# EAGLE schematic bird_beaks (EAGLE 9.6.2)
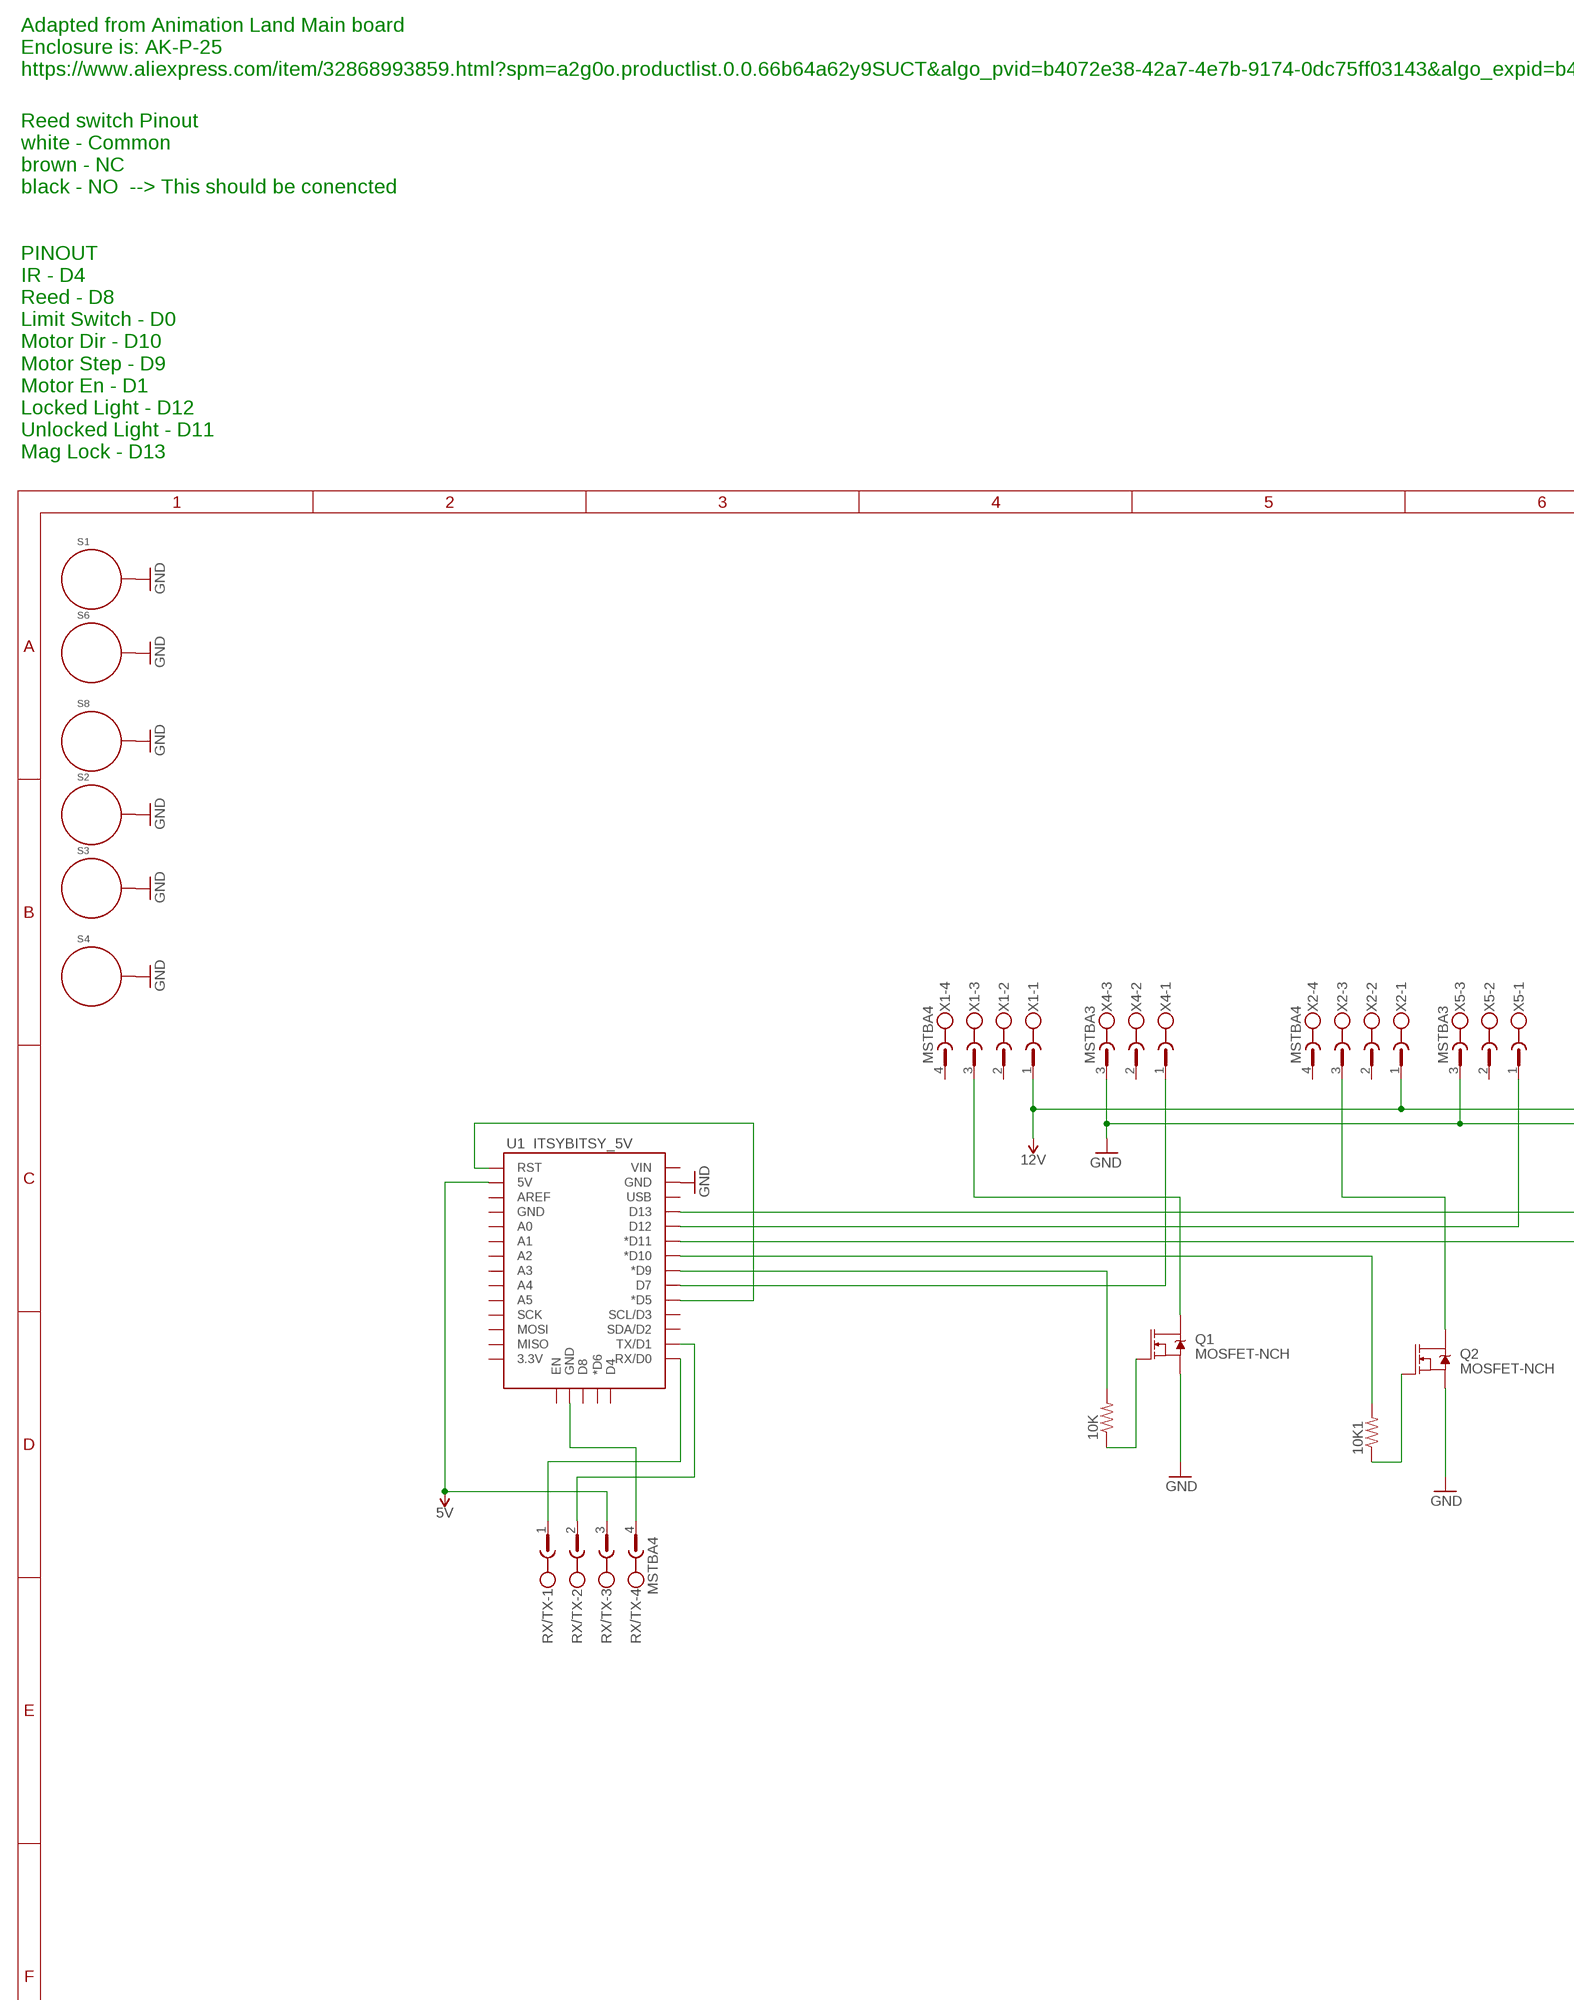
[diagram p0: schematic, sheet 1, part 1 of 2]
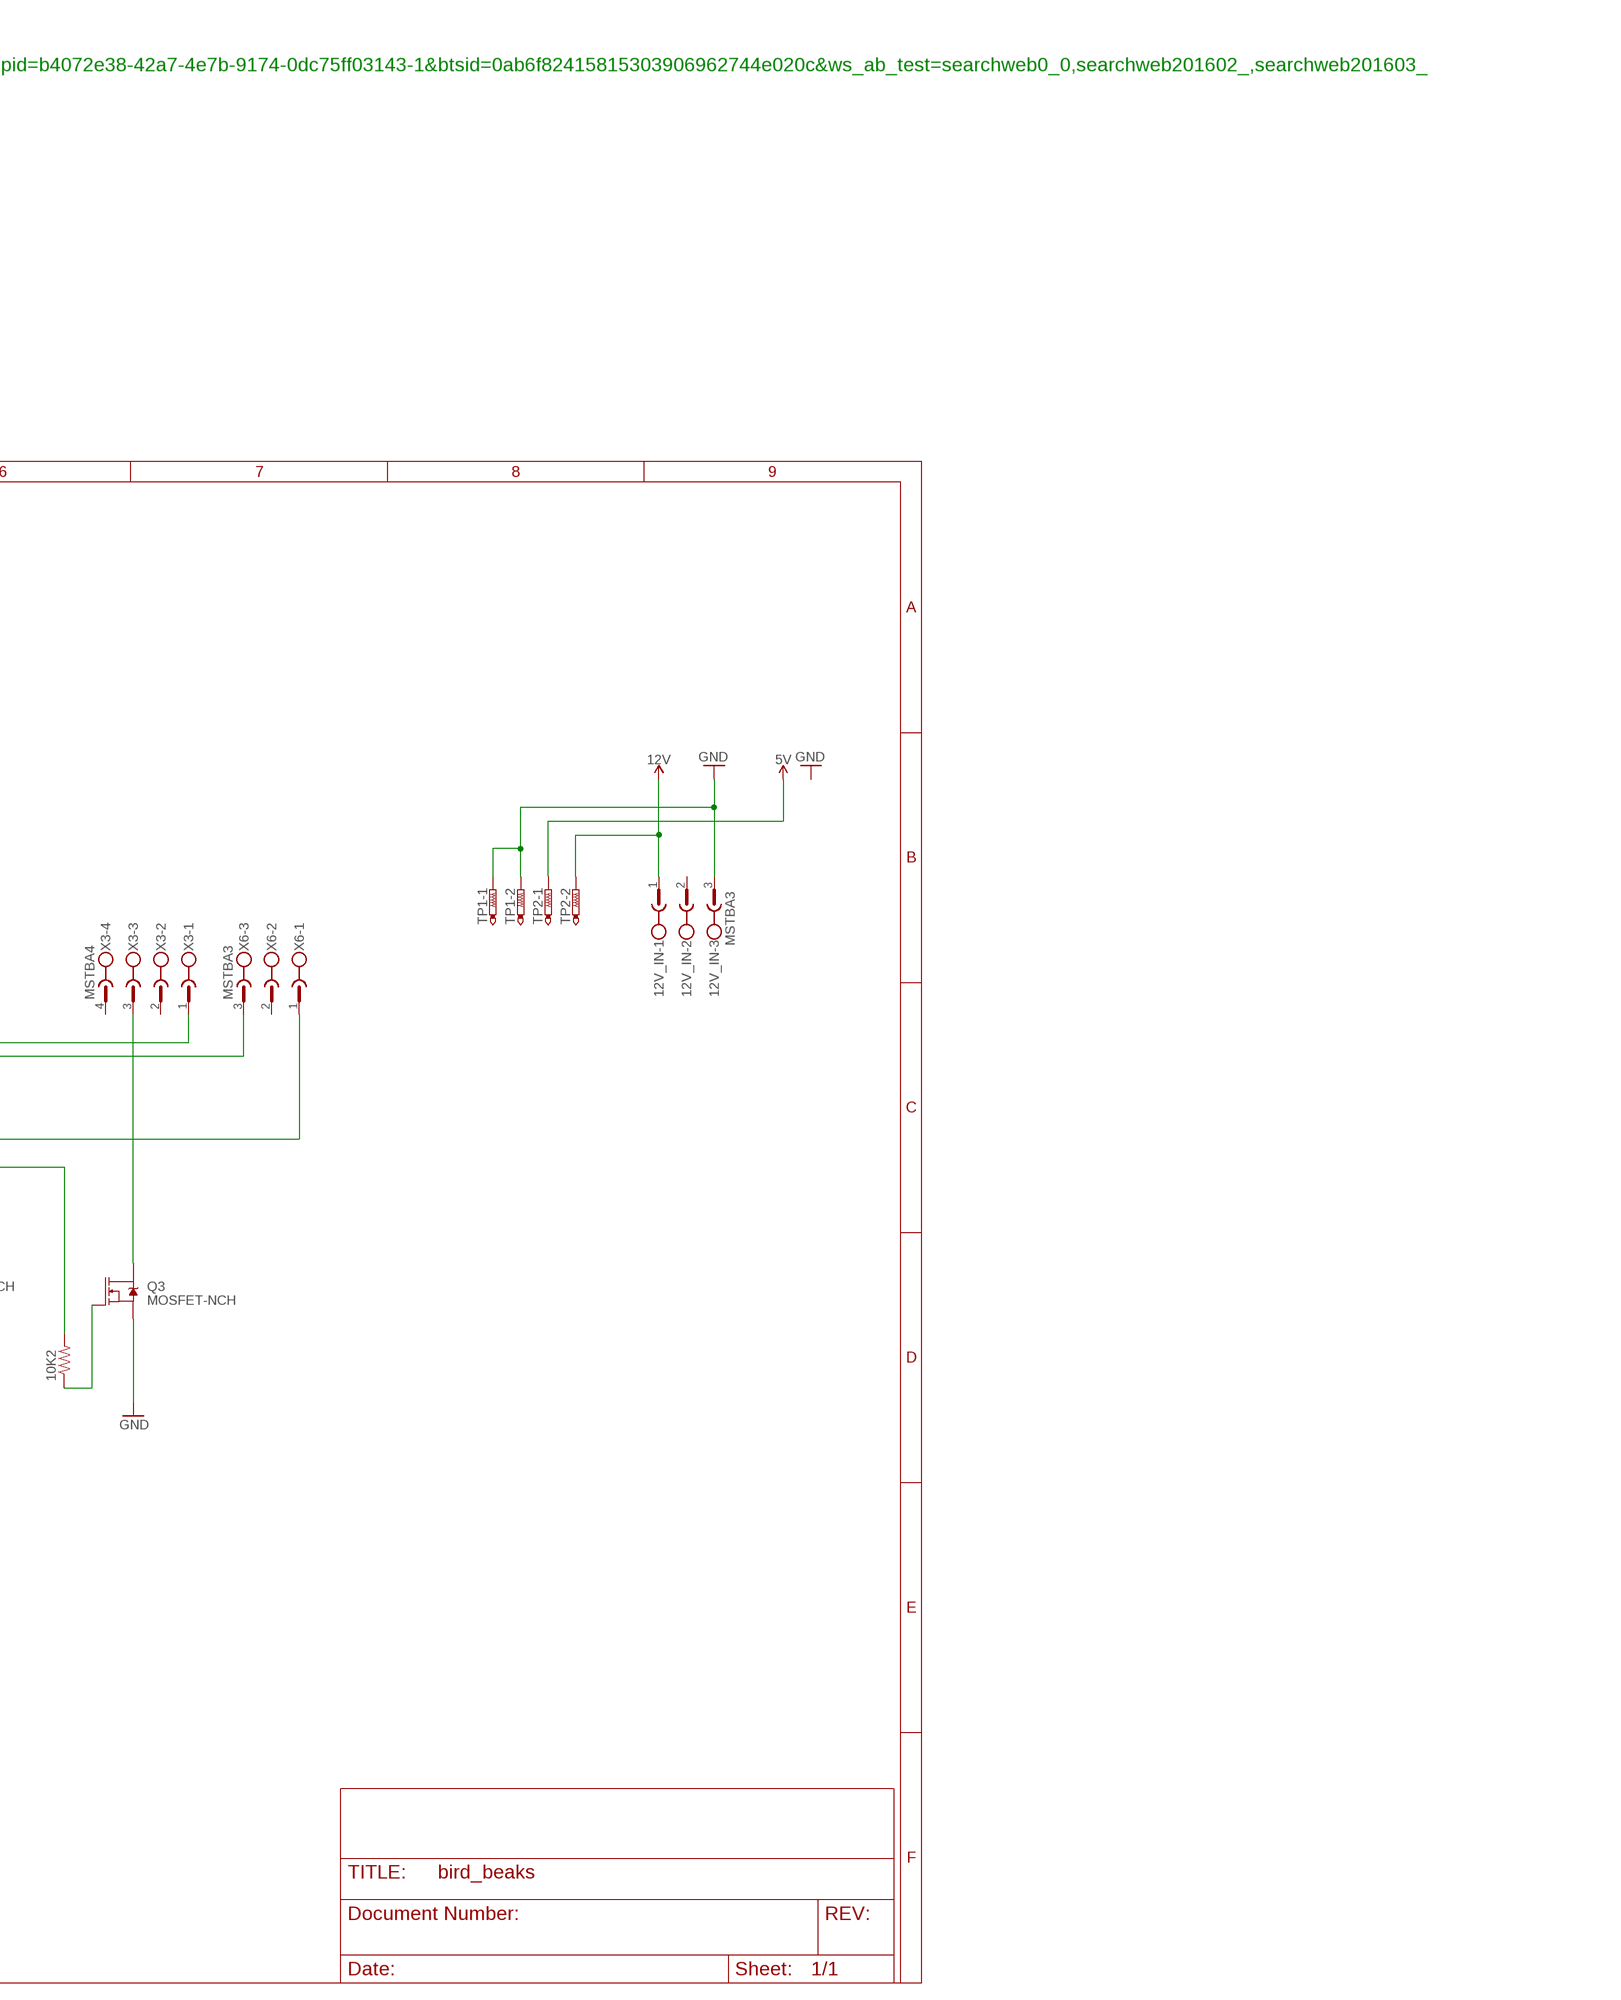
[diagram p1: schematic, sheet 1, part 2 of 2]

## Parts
10K  R-US_M0805  [M0805]
10K1  R-US_M0805  [M0805]
10K2  R-US_M0805  [M0805]
12V_IN  MSTBA3  [MSTBA3]
Q1  MOSFET-NCH  [SO-8_POWER_PAK]
Q2  MOSFET-NCH  [SO-8_POWER_PAK]
Q3  MOSFET-NCH  [SO-8_POWER_PAK]
RX/TX  MSTBA4  [MSTBA4]
S1  STANDOFF_ELECTRICAL5-32  [STANDOFF_ELECTRICAL_5_32]
S2  STANDOFF_ELECTRICAL5-32  [STANDOFF_ELECTRICAL_5_32]
S3  STANDOFF_ELECTRICAL5-32  [STANDOFF_ELECTRICAL_5_32]
S4  STANDOFF_ELECTRICAL5-32  [STANDOFF_ELECTRICAL_5_32]
S6  STANDOFF_ELECTRICAL5-32  [STANDOFF_ELECTRICAL_5_32]
S8  STANDOFF_ELECTRICAL5-32  [STANDOFF_ELECTRICAL_5_32]
TP1  PTR2  [P2-38-17]
TP2  PTR2  [P2-38-17]
U1  ITSYBITSY_5V  [ADAFRUIT_LENOARDO]
X1  MSTBA4  [MSTBA4]
X2  MSTBA4  [MSTBA4]
X3  MSTBA4  [MSTBA4]
X4  MSTBA3  [MSTBA3]
X5  MSTBA3  [MSTBA3]
X6  MSTBA3  [MSTBA3]

## Nets
5V: RX/TX.3 TP2.TP-1 U1.5V
12V: 12V_IN.1 TP2.TP-2 X1.1 X2.1 X3.1
D7: U1.D7 X4.1
D9: 10K.2 U1.D9(*D9)
D10: 10K1.2 U1.D10(*D10)
D11: 10K2.2 U1.D11(*D11)
D12: U1.D12 X5.1
D13: U1.D13 X6.1
GND: 12V_IN.3 Q1.S Q2.S Q3.S S1.P1 S2.P1 S3.P1 S4.P1 S6.P1 S8.P1 TP1.TP-1 TP1.TP-2 U1.GND@2(GND) X4.3 X5.3 X6.3
N$1: 10K2.1 Q3.G
N$2: 10K.1 Q1.G
N$3: U1.D5(*D5) U1.RES(RST)
N$5: Q1.D1(D) X1.3
N$7: 10K1.1 Q2.G
N$8: RX/TX.2 U1.TX(TX/D1)
N$9: Q2.D1(D) X2.3
N$10: RX/TX.4 U1.GND@1(GND)
N$11: RX/TX.1 U1.RX(RX/D0)
N$12: Q3.D1(D) X3.3
Unconnected: 12V_IN.2 U1.3V(3.3V) U1.A0 U1.A1 U1.A2 U1.A3 U1.A4 U1.A5 U1.AREF U1.D4 U1.D6(*D6) U1.D8 U1.EN U1.GND@0(GND) U1.MISO U1.MOSI U1.SCK U1.SCL(SCL/D3) U1.SDA(SDA/D2) U1.USB U1.VIN X1.2 X1.4 X2.2 X2.4 X3.2 X3.4 X4.2 X5.2 X6.2

## Notes on the sheet
- Adapted from Animation Land Main board
  Enclosure is: AK-P-25
  https://www.aliexpress.com/item/32868993859.html?spm=a2g0o.productlist.0.0.66b64a62y9SUCT&algo_pvid=b4072e38-42a7-4e7b-9174-0dc75ff03143&algo_expid=b4072e38-42a7-4e7b-9174-0dc75ff03143-1&btsid=0ab6f82415815303906962744e020c&ws_ab_test=searchweb0_0,searchweb201602_,searchweb201603_
- Reed switch Pinout
  white - Common
  brown - NC
  black - NO  --> This should be conencted
  
  
  PINOUT
  IR - D4
  Reed - D8
  Limit Switch - D0
  Motor Dir - D10
  Motor Step - D9
  Motor En - D1
  Locked Light - D12
  Unlocked Light - D11
  Mag Lock - D13

## Library data of the parts
10K 10K1 10K2 = adafruit:R-US_: RESISTOR, American symbol
12V_IN X4-X6 = con-phoenix-508:MSTBA3: PHOENIX; MF: FARNELL; MPN: 1757255; OC_FARNELL: 3705183; OC_NEWARK: 71C4162
Q1-Q3 = th_ds_libraries:MOSFET-NCH: N-channel MOSFETs from Sparkfun-DiscreteSemi Library
RX/TX = th_libraries:MSTBA4: PHOENIX; MF: FARNELL; MPN: 1757268; OC_FARNELL: 3705195; OC_NEWARK: 71C4163
S1-S4 S6 S8 = th_libraries:STANDOFF_ELECTRICAL: A standoff intended to be an electrically connected point. Pad size and stop size allow for a #8 Phillips pan screw head to make a solid connection to the board. Added 144mill drill hole that fits my normal wood screw
TP1 TP2 = testpad:PTR2: TEST PIN
U1 = th_ds_libraries:ITSYBITSY_5V: Adafruit ItsyBitsy 32u4 - 5V 16MHz https://www.adafruit.com/product/3677
X1-X3 = con-phoenix-508:MSTBA4: PHOENIX; MF: FARNELL; MPN: 1757268; OC_FARNELL: 3705195; OC_NEWARK: 71C4163